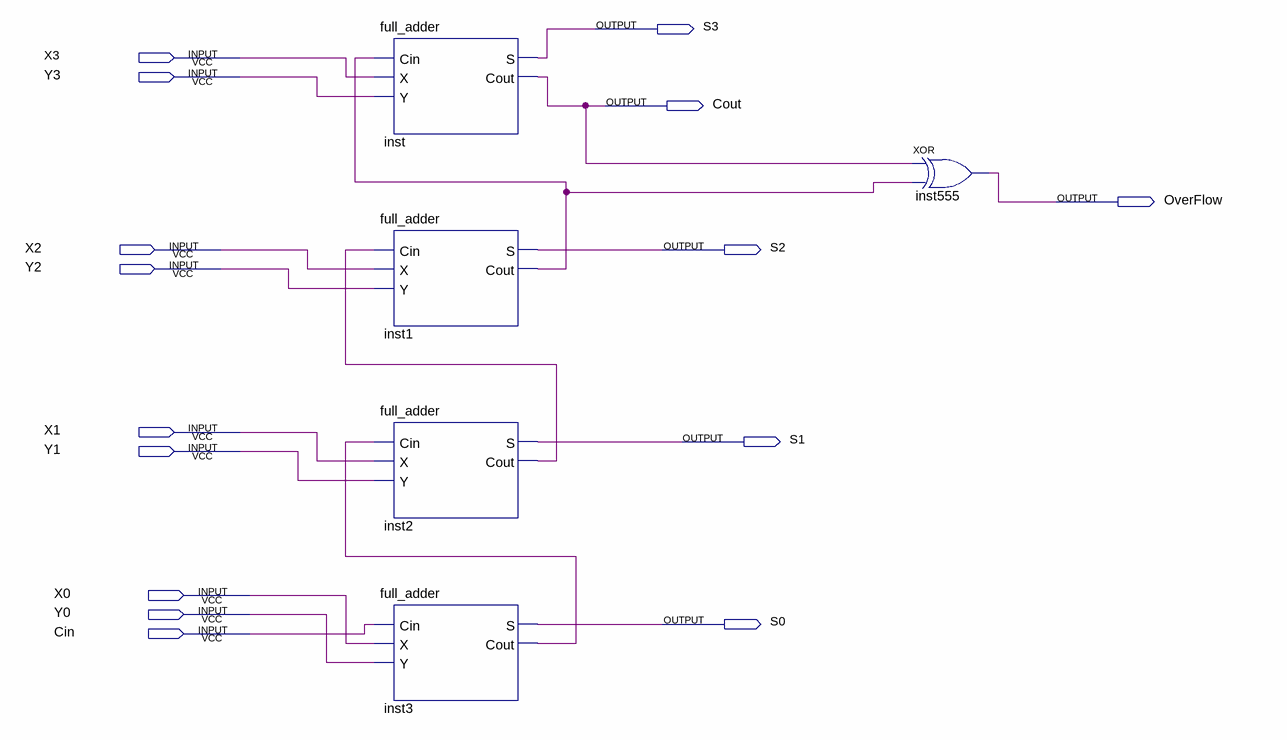
[diagram p0: schematic sheet]
// Quartus schematic adder_4_bit.bdf as structural Verilog: 5 symbols, 15 pins
module adder_4_bit (
  input  X3,
  input  Y3,
  input  X2,
  input  Y2,
  input  X1,
  input  Y1,
  input  X0,
  input  Y0,
  input  Cin,
  output S3,
  output Cout,
  output OverFlow,
  output S2,
  output S1,
  output S0
);

  wire inst1_cout, inst2_cout, inst3_cout;

  full_adder inst (.Cin(inst1_cout), .X(X3), .Y(Y3), .S(S3), .Cout(Cout));
  full_adder inst1 (.Cin(inst2_cout), .X(X2), .Y(Y2), .S(S2), .Cout(inst1_cout));
  full_adder inst2 (.Cin(inst3_cout), .X(X1), .Y(Y1), .S(S1), .Cout(inst2_cout));
  full_adder inst3 (.Cin(Cin), .X(X0), .Y(Y0), .S(S0), .Cout(inst3_cout));
  xor inst555 (OverFlow, Cout, inst1_cout);
endmodule
